# Altium schematic sheet WIFI-BT.SchDoc
size A3
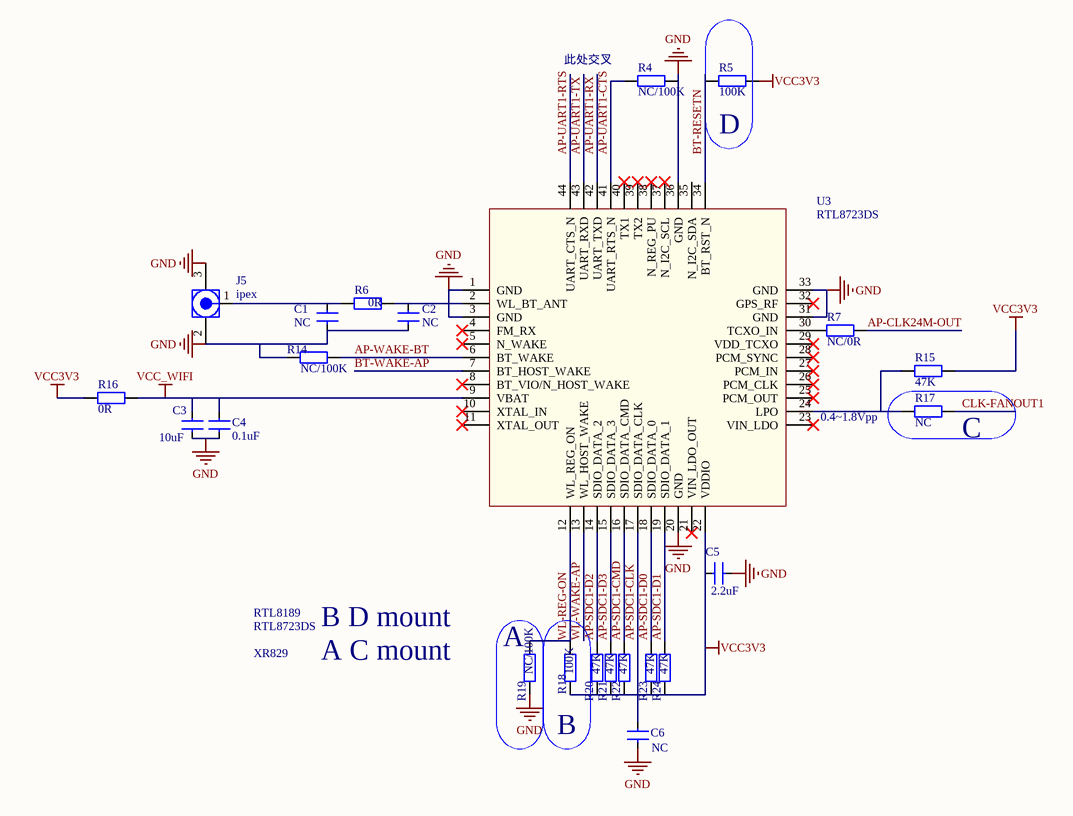
[diagram p0: WIFI-BT.SchDoc]

## Parts
C1  NC  [C0402]
C2  NC  [C0402]
C3  10uF  [C0402]
C4  0.1uF  [C0402]
C5  2.2uF  [C0402]
C6  NC  [C0402]
J5  ipex  [I-PEX SOCKET]
R4  NC/100K  [R0402]
R5  100K  [R0402]
R6  0R  [R0402]
R7  NC/0R  [R0402]
R14  NC/100K  [R0402]
R15  47K  [R0402]
R16  0R  [R0402]
R17  NC  [R0402]
R18  100K  [R0402]
R19  NC/100K  [R0402]
R20  47K  [R0402]
R21  47K  [R0402]
R22  47K  [R0402]
R23  47K  [R0402]
R24  47K  [R0402]
U3  RTL8723DS  [RTL8723DS]

## Blocks framed on the sheet
D: R5
A: R19
B: R18

## Nets
GND: C1.1 C2.1 C3.1 C4.1 C5.1 C6.1 J5.2(GND) J5.3(GND) R4.1 R14.2 R19.1 U3.1(GND) U3.3(GND) U3.20(GND) U3.31(GND) U3.33(GND) U3.36(GND)
VCC3V3: C5.2 R5.1 R15.2 R16.2 R18.1 R20.1 R21.1 R22.1 R23.1 R24.1 U3.22(VDDIO)
VCC_WIFI: C3.2 C4.2 R16.1 U3.9(VBAT)
AP-CLK24M-OUT: R7.1
AP-SDC1-CLK: C6.2 U3.17(SDIO_DATA_CLK)
AP-SDC1-CMD: R22.2 U3.16(SDIO_DATA_CMD)
AP-SDC1-D0: R23.2 U3.18(SDIO_DATA_0)
AP-SDC1-D1: R24.2 U3.19(SDIO_DATA_1)
AP-SDC1-D2: R20.2 U3.14(SDIO_DATA_2)
AP-SDC1-D3: R21.2 U3.15(SDIO_DATA_3)
AP-UART1-CTS: R4.2 U3.41(UART_RTS_N)
AP-UART1-RTS: U3.44(UART_CTS_N)
AP-UART1-RX: U3.42(UART_TXD)
AP-UART1-TX: U3.43(UART_RXD)
AP-WAKE-BT: R14.1 U3.6(BT_WAKE)
BT-RESETN: R5.2 U3.34(BT_RST_N)
BT-WAKE-AP: U3.7(BT_HOST_WAKE)
CLK-FANOUT1: R17.1
WL-REG-ON: R18.2 R19.2 U3.12(WL_REG_ON)
WL-WAKE-AP: U3.13(WL_HOST_WAKE)
NetC1_2: C1.2 J5.1(Signal) R6.2
NetC2_2: C2.2 R6.1 U3.2(WL_BT_ANT)
NetR7_2: R7.2 U3.30(TCXO_IN)
NetR15_1: R15.1 R17.2 U3.24(LPO)

Not connected (* = marked no-connect by the designer): U3 4(FM_RX)* 5(N_WAKE)* 8(BT_VIO/N_HOST_WAKE)* 10(XTAL_IN)* 11(XTAL_OUT)* 21(VIN_LDO_OUT)* 23(VIN_LDO)* 25(PCM_OUT)* 26(PCM_CLK)* 27(PCM_IN)* 28(PCM_SYNC)* 29(VDD_TCXO)* 32(GPS_RF)* 35(N_I2C_SDA) 37(N_I2C_SCL)* 38(N_REG_PU)* 39(TX2)* 40(TX1)*

## Notes on the sheet
- (near R4) 此处交叉
- 0.4~1.8Vpp
- (near R17) C
- RTL8723DS
- XR829
- RTL8189
- B D mount
- A C mount

## Library data of the parts
C1-C6 = CAP: 普通小电容
J5 = MCX_IPEX
R4-R7 R14-R24 = RES: 普通电阻
U3 = AP6212